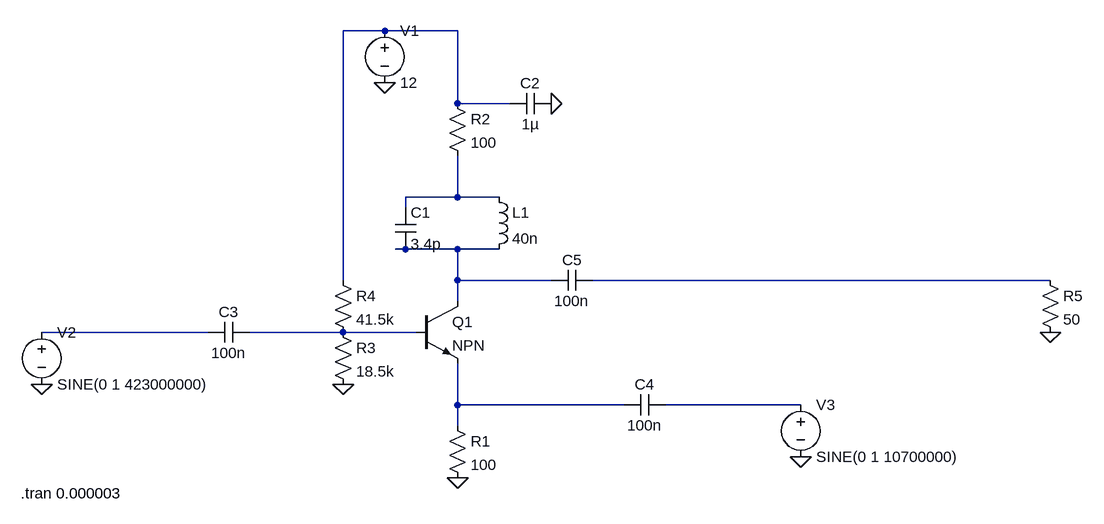
[diagram p0: schematic 433_Mhz_oscillator_and_mixer.asc]
433_Mhz_oscillator_and_mixer.asc, the LTspice schematic file:
Version 4
SHEET 1 1192 680
WIRE 112 -288 48 -288
WIRE 224 -288 112 -288
WIRE 224 -176 224 -288
WIRE 304 -176 224 -176
WIRE 224 -32 224 -96
WIRE 224 -32 144 -32
WIRE 288 -32 224 -32
WIRE 144 -16 144 -32
WIRE 144 48 128 48
WIRE 224 48 144 48
WIRE 288 48 224 48
WIRE 48 96 48 -288
WIRE 224 96 224 48
WIRE 368 96 224 96
WIRE 1136 96 432 96
WIRE 224 128 224 96
WIRE -160 176 -416 176
WIRE 48 176 -96 176
WIRE 160 176 48 176
WIRE 224 288 224 224
WIRE 480 288 224 288
WIRE 752 288 544 288
WIRE 224 320 224 288
FLAG 48 256 0
FLAG 224 400 0
FLAG 112 -208 0
FLAG 752 368 0
FLAG -416 256 0
FLAG 368 -176 0
FLAG 1136 176 0
SYMBOL npn 160 128 R0
SYMATTR InstName Q1
SYMBOL res 208 304 R0
SYMATTR InstName R1
SYMATTR Value 100
SYMBOL cap 128 -16 R0
SYMATTR InstName C1
SYMATTR Value 3.4p
SYMBOL ind 272 -48 R0
SYMATTR InstName L1
SYMATTR Value 40n
SYMBOL res 208 -192 R0
SYMATTR InstName R2
SYMATTR Value 100
SYMBOL res 32 160 R0
SYMATTR InstName R3
SYMATTR Value 18.5k
SYMBOL res 32 80 R0
SYMATTR InstName R4
SYMATTR Value 41.5k
SYMBOL voltage 112 -304 R0
WINDOW 123 0 0 Left 0
WINDOW 39 0 0 Left 0
SYMATTR InstName V1
SYMATTR Value 12
SYMBOL voltage -416 160 R0
WINDOW 123 0 0 Left 0
WINDOW 39 0 0 Left 0
SYMATTR InstName V2
SYMATTR Value SINE(0 1 423000000)
SYMBOL voltage 752 272 R0
WINDOW 123 0 0 Left 0
WINDOW 39 0 0 Left 0
SYMATTR InstName V3
SYMATTR Value SINE(0 1 10700000)
SYMBOL cap -96 160 R90
WINDOW 0 0 32 VBottom 2
WINDOW 3 32 32 VTop 2
SYMATTR InstName C3
SYMATTR Value 100n
SYMBOL cap 544 272 R90
WINDOW 0 0 32 VBottom 2
WINDOW 3 32 32 VTop 2
SYMATTR InstName C4
SYMATTR Value 100n
SYMBOL cap 432 80 R90
WINDOW 0 0 32 VBottom 2
WINDOW 3 32 32 VTop 2
SYMATTR InstName C5
SYMATTR Value 100n
SYMBOL cap 368 -192 R90
WINDOW 0 0 32 VBottom 2
WINDOW 3 32 32 VTop 2
SYMATTR InstName C2
SYMATTR Value 1µ
SYMBOL res 1120 80 R0
SYMATTR InstName R5
SYMATTR Value 50
TEXT -448 424 Left 2 !.tran 0.000003

The netlist it stands for:
* 433_Mhz_oscillator_and_mixer.asc
Q1 N003 N006 N007 0 NPN
R1 N007 0 100
C1 N002 N003 3.4p
L1 N002 N003 40n
R2 N001 N002 100
R3 N006 0 18.5k
R4 N001 N006 41.5k
V1 N001 0 12
V2 N005 0 SINE(0 1 423000000)
V3 N008 0 SINE(0 1 10700000)
C3 N006 N005 100n
C4 N008 N007 100n
C5 N004 N003 100n
C2 0 N001 1µ
R5 N004 0 50
.model NPN NPN
.model PNP PNP
.lib standard.bjt
.tran 0.000003
.backanno
.end